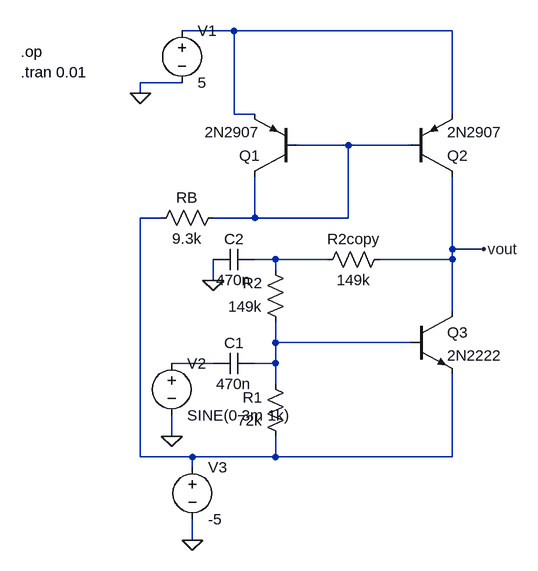
[diagram p0: schematic test4.asc]
test4.asc, the LTspice schematic file:
Version 4
SHEET 1 880 736
WIRE 144 -64 64 -64
WIRE 480 -64 144 -64
WIRE 64 16 0 16
WIRE 0 32 0 16
WIRE 144 64 144 -64
WIRE 176 64 144 64
WIRE 480 64 480 -64
WIRE 320 112 240 112
WIRE 416 112 320 112
WIRE 32 224 0 224
WIRE 176 224 176 160
WIRE 176 224 112 224
WIRE 320 224 320 112
WIRE 320 224 176 224
WIRE 480 272 480 160
WIRE 528 272 480 272
WIRE 208 288 176 288
WIRE 288 288 208 288
WIRE 480 288 480 272
WIRE 480 288 368 288
WIRE 208 304 208 288
WIRE 112 320 112 288
WIRE 480 368 480 288
WIRE 208 416 208 384
WIRE 416 416 208 416
WIRE 112 448 48 448
WIRE 208 448 208 416
WIRE 208 448 176 448
WIRE 208 480 208 448
WIRE 48 560 48 528
WIRE 0 592 0 224
WIRE 80 592 0 592
WIRE 208 592 208 560
WIRE 208 592 80 592
WIRE 480 592 480 464
WIRE 480 592 208 592
WIRE 80 608 80 592
WIRE 80 720 80 688
FLAG 80 720 0
FLAG 0 32 0
FLAG 112 320 0
FLAG 48 560 0
FLAG 528 272 vout
SYMBOL voltage 64 -80 R0
SYMATTR InstName V1
SYMATTR Value 5
SYMBOL pnp 240 160 R180
SYMATTR InstName Q1
SYMATTR Value 2N2907
SYMBOL pnp 416 160 M180
SYMATTR InstName Q2
SYMATTR Value 2N2907
SYMBOL res 384 272 R90
WINDOW 0 0 56 VBottom 2
WINDOW 3 32 56 VTop 2
SYMATTR InstName R2copy
SYMATTR Value 149k
SYMBOL res 224 400 R180
WINDOW 0 36 76 Left 2
WINDOW 3 36 40 Left 2
SYMATTR InstName R2
SYMATTR Value 149k
SYMBOL res 224 576 R180
WINDOW 0 36 76 Left 2
WINDOW 3 36 40 Left 2
SYMATTR InstName R1
SYMATTR Value 72k
SYMBOL cap 176 432 R90
WINDOW 0 0 32 VBottom 2
WINDOW 3 32 32 VTop 2
SYMATTR InstName C1
SYMATTR Value 470n
SYMBOL cap 176 272 R90
WINDOW 0 0 32 VBottom 2
WINDOW 3 32 32 VTop 2
SYMATTR InstName C2
SYMATTR Value 470n
SYMBOL npn 416 368 R0
SYMATTR InstName Q3
SYMATTR Value 2N2222
SYMBOL res 128 208 R90
WINDOW 0 0 56 VBottom 2
WINDOW 3 32 56 VTop 2
SYMATTR InstName RB
SYMATTR Value 9.3k
SYMBOL voltage 48 432 R0
SYMATTR InstName V2
SYMATTR Value SINE(0 3m 1k)
SYMATTR Value2 AC 3m
SYMBOL voltage 80 592 R0
SYMATTR InstName V3
SYMATTR Value -5
TEXT -184 -32 Left 2 !.op\n.tran 0.01

The netlist it stands for:
* test4.asc
V1 N001 0 5
Q1 N002 N002 N001 0 2N2907
Q2 vout N002 N001 0 2N2907
R2copy vout N004 149k
R2 N005 N004 149k
R1 N003 N005 72k
C1 N005 N006 470n
C2 N004 0 470n
Q3 vout N005 N003 0 2N2222
RB N002 N003 9.3k
V2 N006 0 SINE(0 3m 1k) AC 3m
V3 N003 0 -5
.model NPN NPN
.model PNP PNP
.lib standard.bjt
.op
.tran 0.01
.backanno
.end